# Altium schematic sheet Conectores.SchDoc
size A4; Engineer: Kayann Soares; SheetNumber: 11; SheetTotal: 11; CompanyInfo1: Universidade Federal do Ceará; CompanyInfo2: Centro de Tecnologia - CT; CompanyInfo3: Dep. de Eng. de Teleinformática
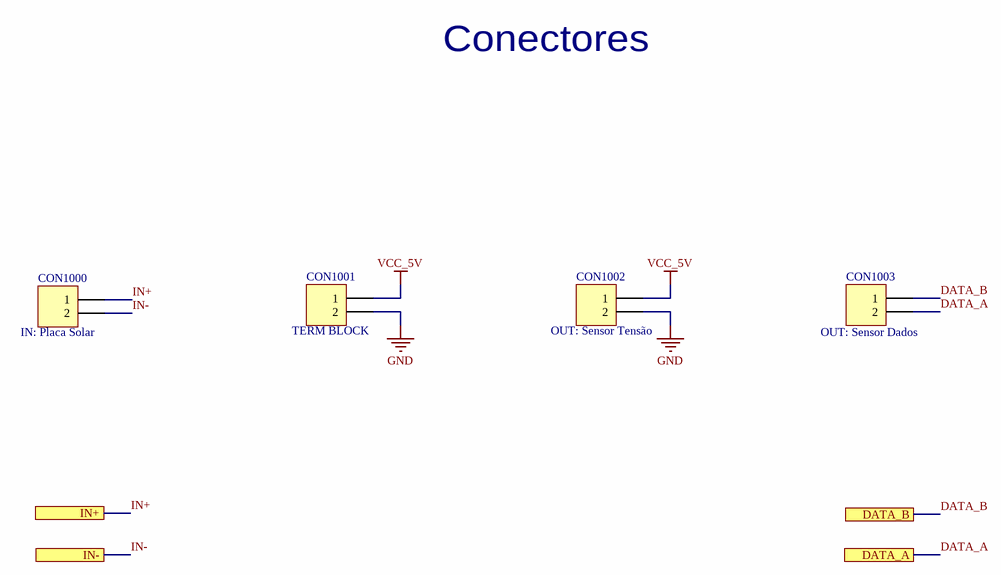
[diagram p0: Conectores.SchDoc]

## Parts
CON1000  IN: Placa Solar  [TERM BLOCK 2POS]
CON1001  TERM BLOCK  [TERM BLOCK 2POS]
CON1002  OUT: Sensor Tensão  [TERM BLOCK 2POS]
CON1003  OUT: Sensor Dados  [TERM BLOCK 2POS]

## Ports
DATA_A, DATA_B, IN+, IN-

## Nets
GND: CON1001.2 CON1002.2
VCC_5V: CON1001.1 CON1002.1
DATA_A: CON1003.2 ; port DATA_A
DATA_B: CON1003.1 ; port DATA_B
IN+: CON1000.1 ; port IN+
IN-: CON1000.2 ; port IN-

## Notes on the sheet
- Conectores
- Título:
- Padrão:
- Projeto:
- Eng. Responsável:
- A4
- Data:
- Versão:
- Folha:
- V1
- de
- Arquivo:

## Library data of the parts
CON1000-CON1003 = TERM BLOCK 2POS: Supplier 1: Newark; Supplier Part Number 1: 71C4161